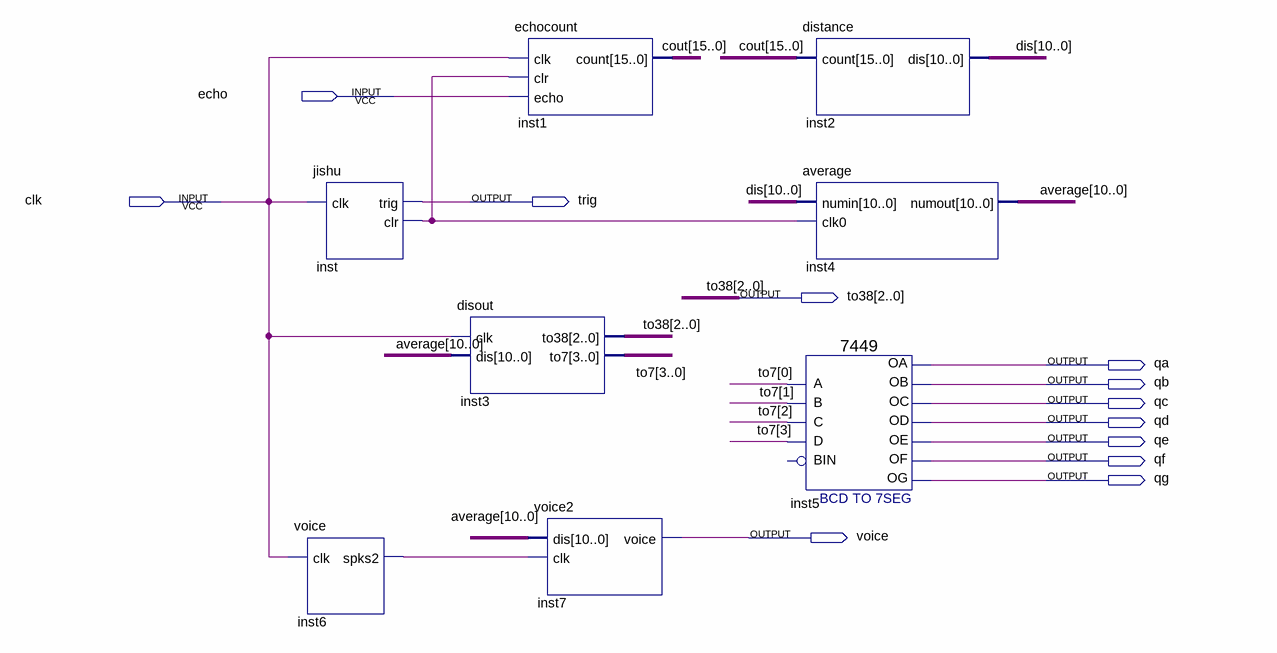
[diagram p0: schematic sheet]
// Quartus schematic daocheleida.bdf as structural Verilog: 8 symbols, 12 pins
module daocheleida (
  input  echo,
  input  clk,
  output trig,
  output [2:0] to38,
  output qa,
  output qb,
  output qc,
  output qd,
  output qe,
  output qf,
  output qg,
  output voice
);

  wire inst6_spks2, inst_clr;
  wire [3:0] to7;
  wire [10:0] average, dis;
  wire [15:0] cout;

  jishu inst (.clk(clk), .trig(trig), .clr(inst_clr));
  voice inst6 (.clk(clk), .spks2(inst6_spks2));
  disout inst3 (.clk(clk), .dis(average), .to38(to38), .to7(to7));
  echocount inst1 (.clk(clk), .clr(inst_clr), .echo(echo), .count(cout));
  voice2 inst7 (.dis(average), .clk(inst6_spks2), .voice(voice));
  distance inst2 (.count(cout), .dis(dis));
  average inst4 (.numin(dis), .clk0(inst_clr), .numout(average));
  \7449  inst5 (
    .A(to7[0]), .C(to7[2]), .B(to7[1]), .D(to7[3]), .OC(qc), .OD(qd), .OF(qf), .OG(qg), .OB(qb), .OA(qa),
    .OE(qe));  // open: BIN
endmodule
